# Altium schematic sheet Sheet1.SchDoc
size A4 portrait; SheetNumber: 1; SheetTotal: 1
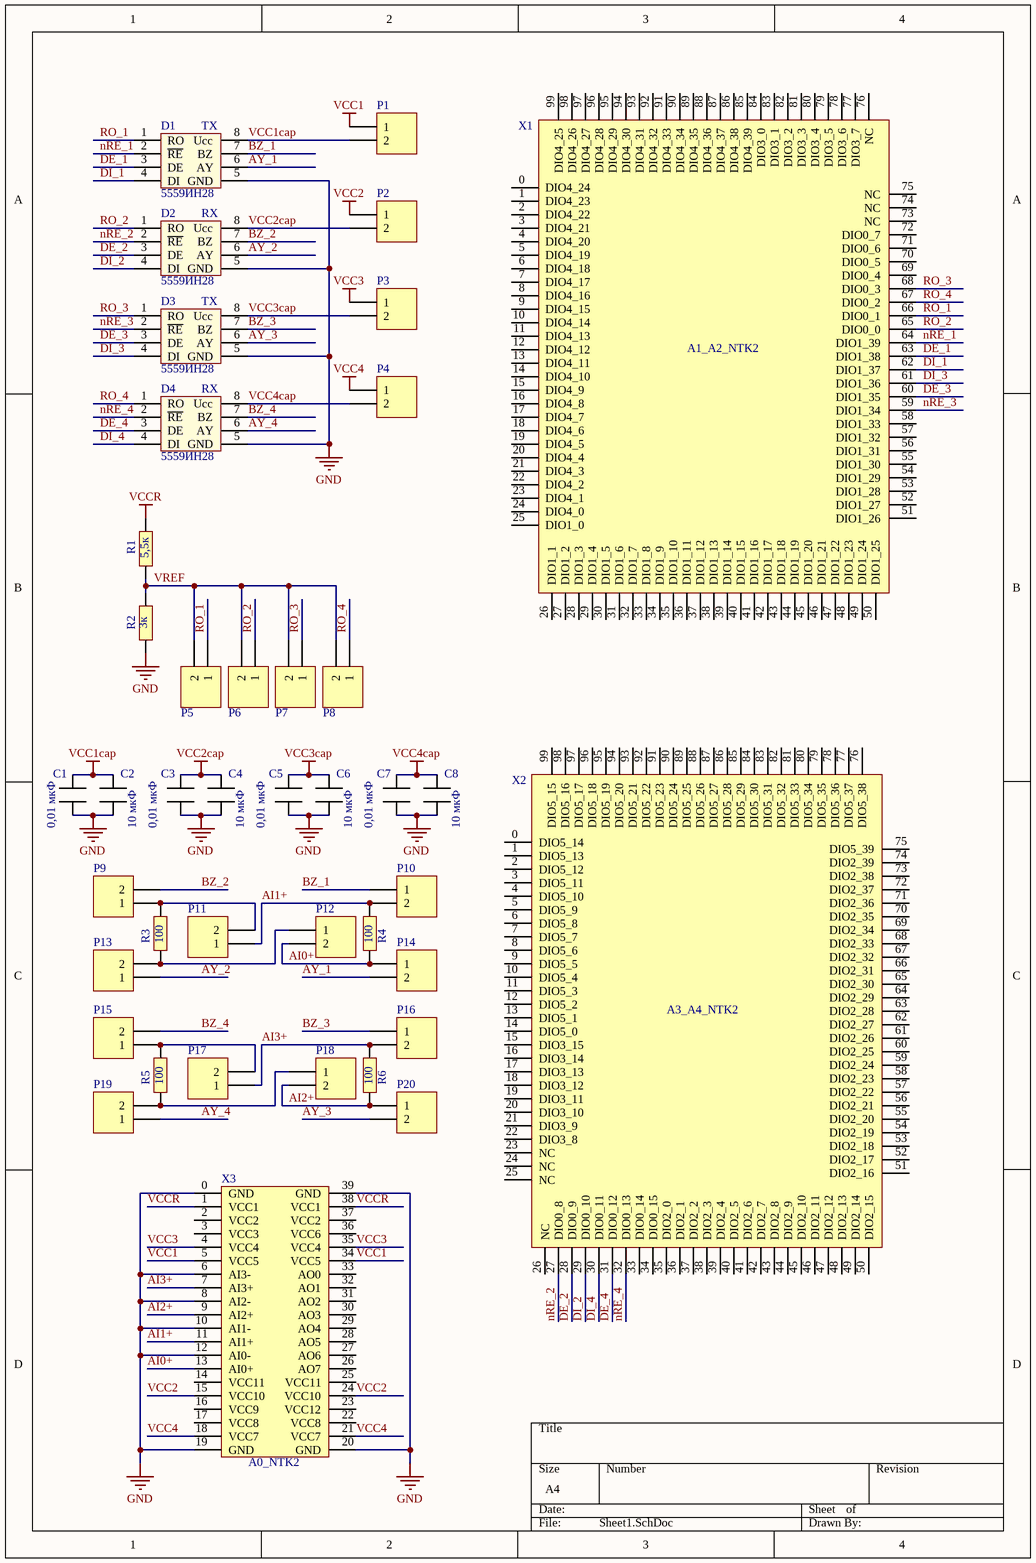
[diagram p0: Sheet1.SchDoc]

## Parts
C1  0,01 мкФ  [CAP_SMALL]
C2  10 мкФ  [Cap_BIG]
C3  0,01 мкФ  [CAP_SMALL]
C4  10 мкФ  [Cap_BIG]
C5  0,01 мкФ  [CAP_SMALL]
C6  10 мкФ  [Cap_BIG]
C7  0,01 мкФ  [CAP_SMALL]
C8  10 мкФ  [Cap_BIG]
D1  5559ИН28  [5559IN28]
D2  5559ИН28  [5559IN28]
D3  5559ИН28  [5559IN28]
D4  5559ИН28  [5559IN28]
P1  Header 2  [HDR1X2]  (value not drawn)
P2  Header 2  [HDR1X2]  (value not drawn)
P3  Header 2  [HDR1X2]  (value not drawn)
P4  Header 2  [HDR1X2]  (value not drawn)
P5  Header 2  [HDR1X2]  (value not drawn)
P6  Header 2  [HDR1X2]  (value not drawn)
P7  Header 2  [HDR1X2]  (value not drawn)
P8  Header 2  [HDR1X2]  (value not drawn)
P9  Header 2  [HDR1X2]  (value not drawn)
P10  Header 2  [HDR1X2]  (value not drawn)
P11  Header 2  [HDR1X2]  (value not drawn)
P12  Header 2  [HDR1X2]  (value not drawn)
P13  Header 2  [HDR1X2]  (value not drawn)
P14  Header 2  [HDR1X2]  (value not drawn)
P15  Header 2  [HDR1X2]  (value not drawn)
P16  Header 2  [HDR1X2]  (value not drawn)
P17  Header 2  [HDR1X2]  (value not drawn)
P18  Header 2  [HDR1X2]  (value not drawn)
P19  Header 2  [HDR1X2]  (value not drawn)
P20  Header 2  [HDR1X2]  (value not drawn)
R1  5,5к  [RES]
R2  3к  [RES]
R3  100  [RES]
R4  100  [RES]
R5  100  [RES]
R6  100  [RES]
X1  A1_A2_NTK2  [A1_A2_NTK2]
X2  A3_A4_NTK2  [A3_A4_NTK2]
X3  A0_NTK2  [A0_NTK2]

## Nets
GND: C1.1 C2.1 C3.1 C4.1 C5.1 C6.1 C7.1 C8.1 D1.5(GND) D2.5(GND) D3.5(GND) D4.5(GND) R2.2 X3.0(GND) X3.6(AI3-) X3.8(AI2-) X3.10(AI1-) X3.12(AI0-) X3.19(GND) X3.20(GND) X3.39(GND)
VCC1: P1.1 X3.5(VCC5) X3.34(VCC5)
VCC1cap: C1.2 C2.2 D1.8(Ucc) P1.2
VCC2: P2.1 X3.15(VCC10) X3.24(VCC10)
VCC2cap: C3.2 C4.2 D2.8(Ucc) P2.2
VCC3: P3.1 X3.4(VCC4) X3.35(VCC4)
VCC3cap: C5.2 C6.2 D3.8(Ucc) P3.2
VCC4: P4.1 X3.18(VCC7) X3.21(VCC7)
VCC4cap: C7.2 C8.2 D4.8(Ucc) P4.2
VCCR: R1.1 X3.1(VCC1) X3.38(VCC1)
AI0+: P12.2 P14.1 R4.2 X3.13(AI0+)
AI1+: P10.2 P11.1 R4.1 X3.11(AI1+)
AI2+: P18.2 P20.1 R6.2 X3.9(AI2+)
AI3+: P16.2 P17.1 R6.1 X3.7(AI3+)
AY_1: D1.6(AY) P14.2
AY_2: D2.6(AY) P13.1
AY_3: D3.6(AY) P20.2
AY_4: D4.6(AY) P19.1
BZ_1: D1.7(BZ) P10.1
BZ_2: D2.7(BZ) P9.2
BZ_3: D3.7(BZ) P16.1
BZ_4: D4.7(BZ) P15.2
DE_1: D1.3(DE) X1.63(DIO1_38)
DE_2: D2.3(DE) X2.28(DIO0_9)
DE_3: D3.3(DE) X1.60(DIO1_35)
DE_4: D4.3(DE) X2.31(DIO0_12)
DI_1: D1.4(DI) X1.62(DIO1_37)
DI_2: D2.4(DI) X2.29(DIO0_10)
DI_3: D3.4(DI) X1.61(DIO1_36)
DI_4: D4.4(DI) X2.30(DIO0_11)
nRE_1: D1.2(~{RE}) X1.64(DIO1_39)
nRE_2: D2.2(~{RE}) X2.27(DIO0_8)
nRE_3: D3.2(~{RE}) X1.59(DIO1_34)
nRE_4: D4.2(~{RE}) X2.32(DIO0_13)
RO_1: D1.1(RO) P5.1 X1.66(DIO0_1)
RO_2: D2.1(RO) P6.1 X1.65(DIO0_0)
RO_3: D3.1(RO) P7.1 X1.68(DIO0_3)
RO_4: D4.1(RO) P8.1 X1.67(DIO0_2)
VREF: P5.2 P6.2 P7.2 P8.2 R1.2 R2.1
NetP9_1: P9.1 P11.2 R3.2
NetP12_1: P12.1 P13.2 R3.1
NetP15_1: P15.1 P17.2 R5.2
NetP18_1: P18.1 P19.2 R5.1

Not connected (* = marked no-connect by the designer): X1 0(DIO4_24) 1(DIO4_23) 2(DIO4_22) 3(DIO4_21) 4(DIO4_20) 5(DIO4_19) 6(DIO4_18) 7(DIO4_17) 8(DIO4_16) 9(DIO4_15) 10(DIO4_14) 11(DIO4_13) 12(DIO4_12) 13(DIO4_11) 14(DIO4_10) 15(DIO4_9) 16(DIO4_8) 17(DIO4_7) 18(DIO4_6) 19(DIO4_5) 20(DIO4_4) 21(DIO4_3) 22(DIO4_2) 23(DIO4_1) 24(DIO4_0) 25(DIO1_0) 26(DIO1_1) 27(DIO1_2) 28(DIO1_3) 29(DIO1_4) 30(DIO1_5) 31(DIO1_6) 32(DIO1_7) 33(DIO1_8) 34(DIO1_9) 35(DIO1_10) 36(DIO1_11) 37(DIO1_12) 38(DIO1_13) 39(DIO1_14) 40(DIO1_15) 41(DIO1_16) 42(DIO1_17) 43(DIO1_18) 44(DIO1_19) 45(DIO1_20) 46(DIO1_21) 47(DIO1_22) 48(DIO1_23) 49(DIO1_24) 50(DIO1_25) 51(DIO1_26) 52(DIO1_27) 53(DIO1_28) 54(DIO1_29) 55(DIO1_30) 56(DIO1_31) 57(DIO1_32) 58(DIO1_33) 69(DIO0_4) 70(DIO0_5) 71(DIO0_6) 72(DIO0_7) 73(NC) 74(NC) 75(NC) 76(NC) 77(DIO3_7) 78(DIO3_6) 79(DIO3_5) 80(DIO3_4) 81(DIO3_3) 82(DIO3_2) 83(DIO3_1) 84(DIO3_0) 85(DIO4_39) 86(DIO4_38) 87(DIO4_37) 88(DIO4_36) 89(DIO4_35) 90(DIO4_34) 91(DIO4_33) 92(DIO4_32) 93(DIO4_31) 94(DIO4_30) 95(DIO4_29) 96(DIO4_28) 97(DIO4_27) 98(DIO4_26) 99(DIO4_25); X2 0(DIO5_14) 1(DIO5_13) 2(DIO5_12) 3(DIO5_11) 4(DIO5_10) 5(DIO5_9) 6(DIO5_8) 7(DIO5_7) 8(DIO5_6) 9(DIO5_5) 10(DIO5_4) 11(DIO5_3) 12(DIO5_2) 13(DIO5_1) 14(DIO5_0) 15(DIO3_15) 16(DIO3_14) 17(DIO3_13) 18(DIO3_12) 19(DIO3_11) 20(DIO3_10) 21(DIO3_9) 22(DIO3_8) 23(NC) 24(NC) 25(NC) 26(NC) 33(DIO0_14) 34(DIO0_15) 35(DIO2_0) 36(DIO2_1) 37(DIO2_2) 38(DIO2_3) 39(DIO2_4) 40(DIO2_5) 41(DIO2_6) 42(DIO2_7) 43(DIO2_8) 44(DIO2_9) 45(DIO2_10) 46(DIO2_11) 47(DIO2_12) 48(DIO2_13) 49(DIO2_14) 50(DIO2_15) 51(DIO2_16) 52(DIO2_17) 53(DIO2_18) 54(DIO2_19) 55(DIO2_20) 56(DIO2_21) 57(DIO2_22) 58(DIO2_23) 59(DIO2_24) 60(DIO2_25) 61(DIO2_26) 62(DIO2_27) 63(DIO2_28) 64(DIO2_29) 65(DIO2_30) 66(DIO2_31) 67(DIO2_32) 68(DIO2_33) 69(DIO2_34) 70(DIO2_35) 71(DIO2_36) 72(DIO2_37) 73(DIO2_38) 74(DIO2_39) 75(DIO5_39) 76(DIO5_38) 77(DIO5_37) 78(DIO5_36) 79(DIO5_35) 80(DIO5_34) 81(DIO5_33) 82(DIO5_32) 83(DIO5_31) 84(DIO5_30) 85(DIO5_29) 86(DIO5_28) 87(DIO5_27) 88(DIO5_26) 89(DIO5_25) 90(DIO5_24) 91(DIO5_23) 92(DIO5_22) 93(DIO5_21) 94(DIO5_20) 95(DIO5_19) 96(DIO5_18) 97(DIO5_17) 98(DIO5_16) 99(DIO5_15); X3 2(VCC2) 3(VCC3) 14(VCC11) 16(VCC9) 17(VCC8) 22(VCC8) 23(VCC12) 25(VCC11) 26(AO7) 27(AO6) 28(AO5) 29(AO4) 30(AO3) 31(AO2) 32(AO1) 33(AO0) 36(VCC6) 37(VCC2)

## Notes on the sheet
- (near D1) TX
- (near D2) RX
- (near D3) TX
- (near D4) RX

## Library data of the parts
C1 C3 C5 C7 = CAP_SMALL
C2 C4 C6 C8 = CAP_BIG
P1-P20 = Header 2: Header, 2-Pin; LatestRevisionDate: 17-Jul-2002; LatestRevisionNote: Re-released for DXP Platform.; Publisher: Altium Limited
R1-R6 = RES